# EAGLE schematic RedundantSensors (EAGLE 9.6.2)

## Sheet 1 of 2
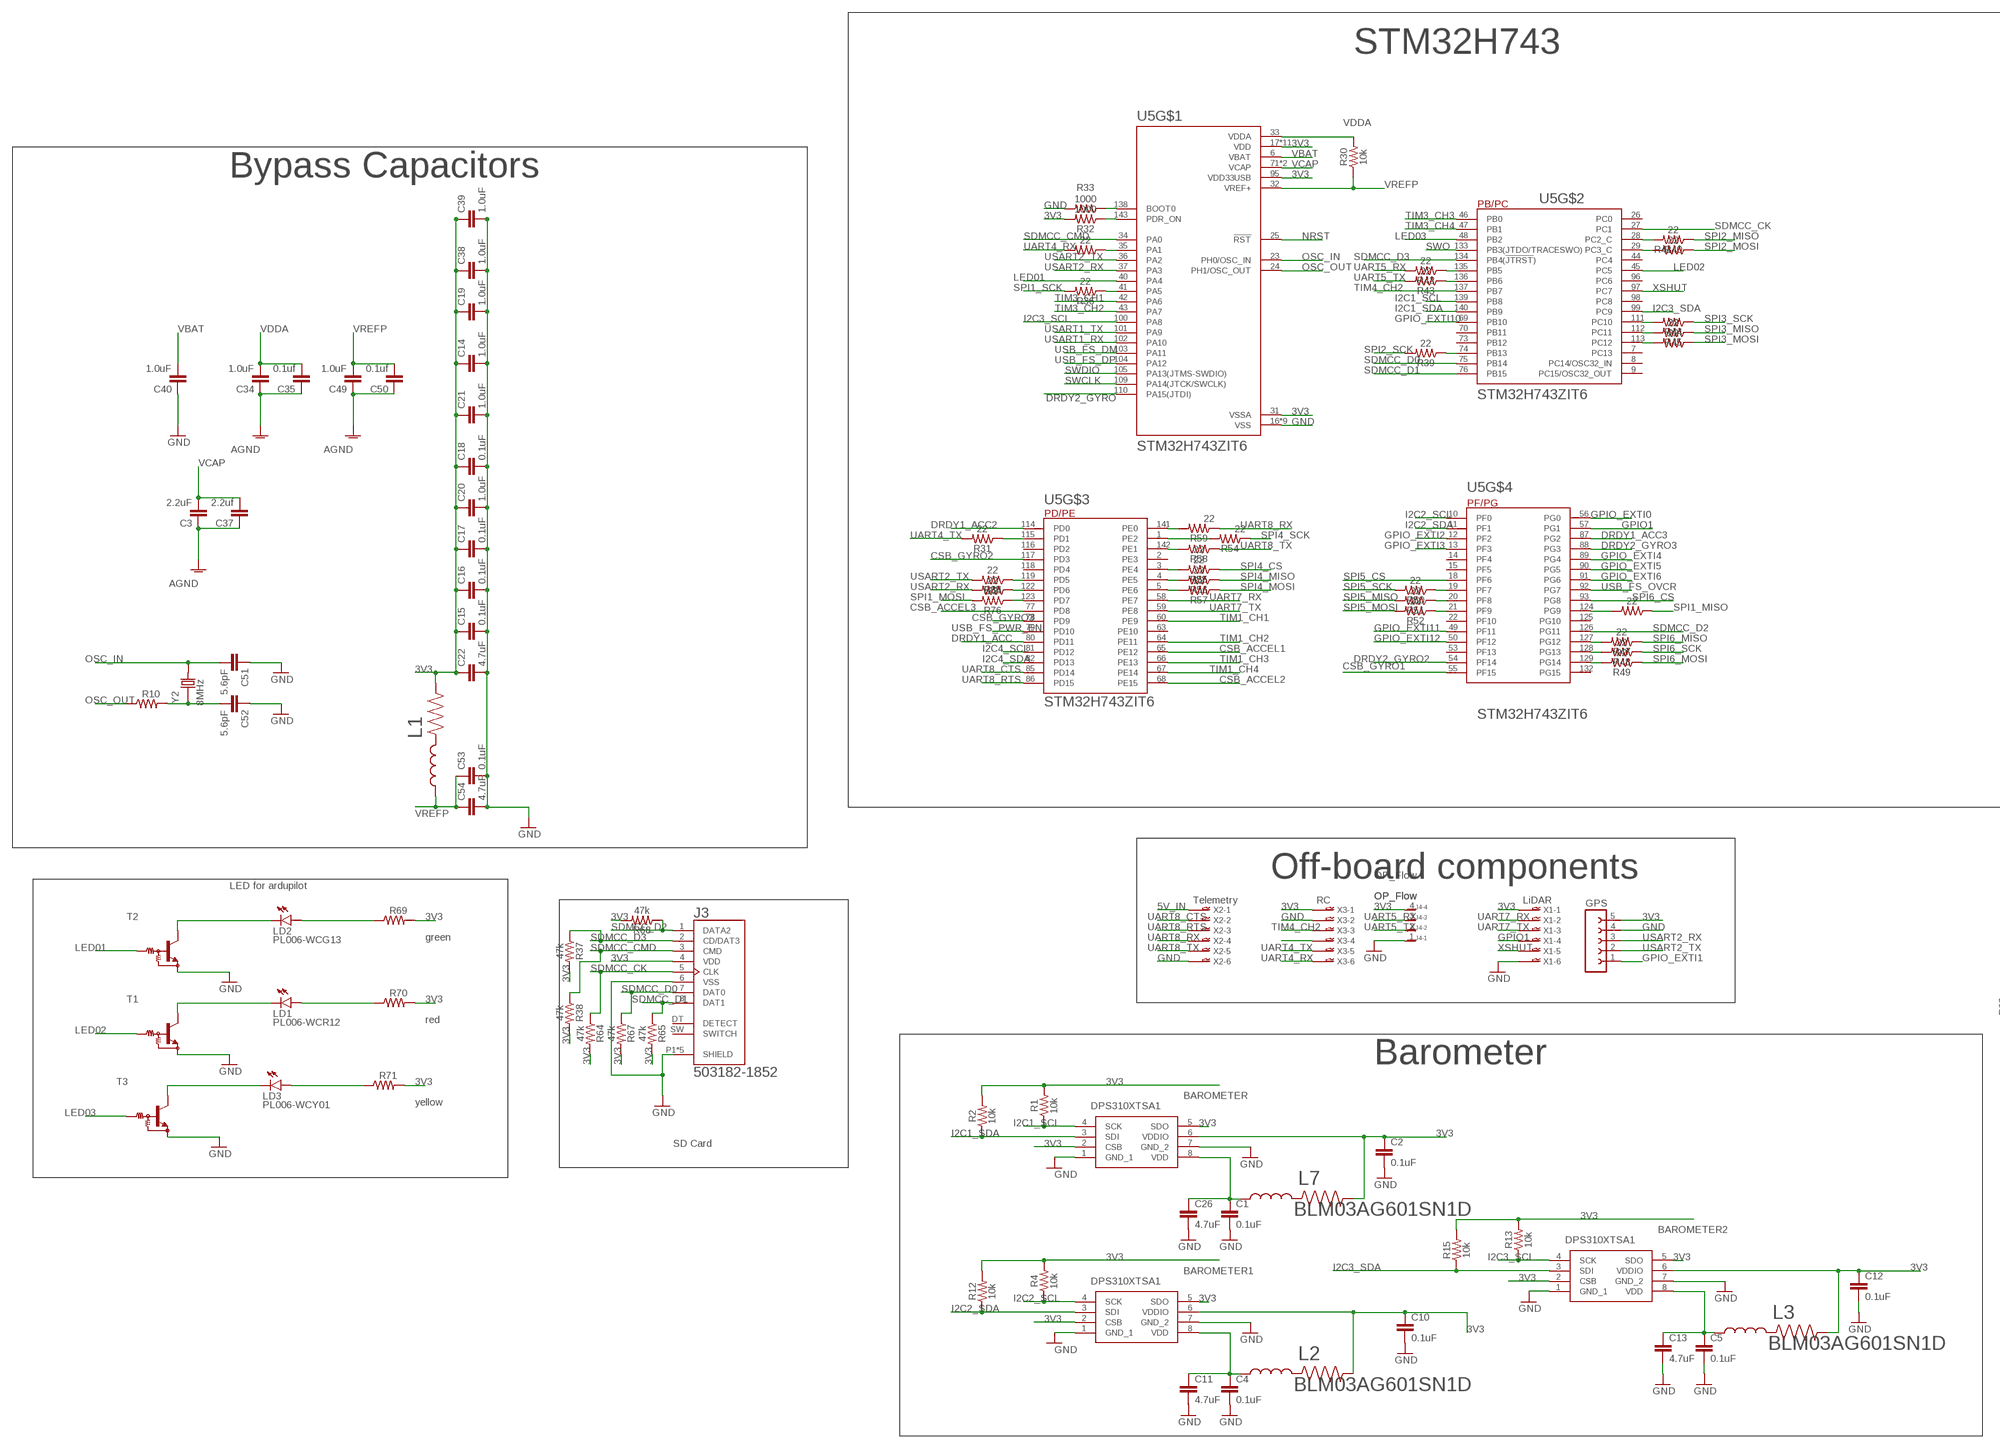
[diagram p0: schematic, sheet 1, part 1 of 2]
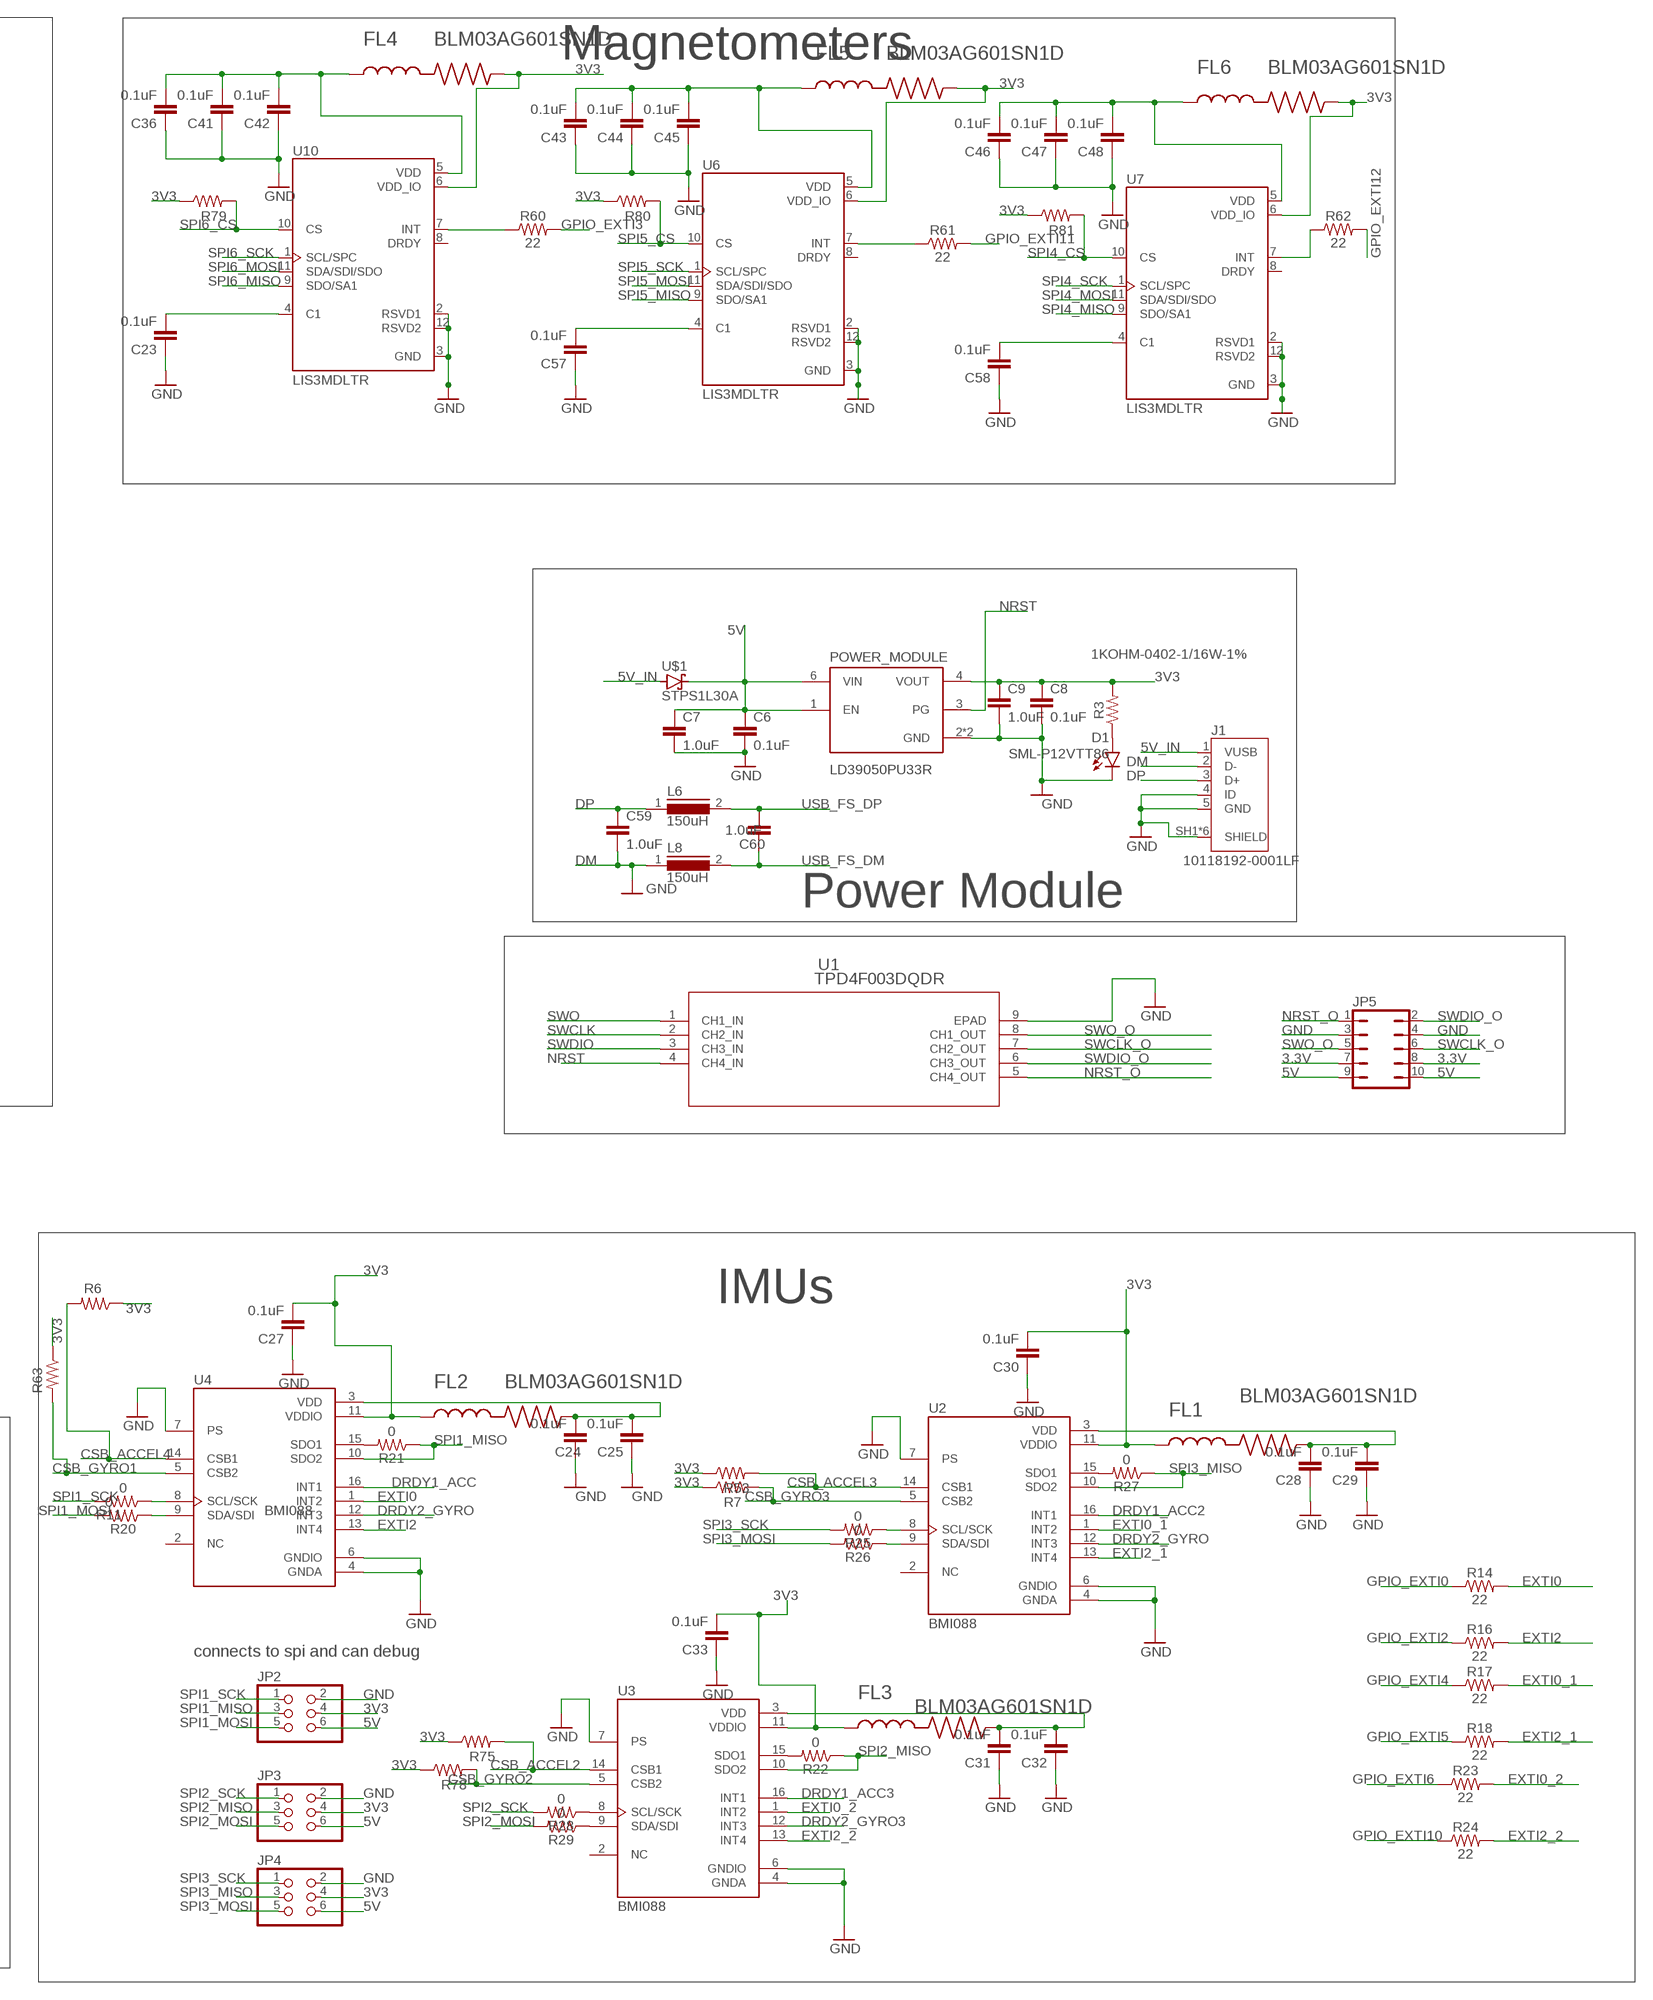
[diagram p1: schematic, sheet 1, part 2 of 2]

### Parts
BAROMETER  DPS310XTSA1  [DPS310XTSA1]
BAROMETER1  DPS310XTSA1  [DPS310XTSA1]
BAROMETER2  DPS310XTSA1  [DPS310XTSA1]
C1  0.1uF  0.1UF-0402-6.3V-10%-X7R  [0402]
C2  0.1uF  0.1UF-0402-6.3V-10%-X7R  [0402]
C3  2.2uF  1.0UF-0805-25V-10%  [0805]
C4  0.1uF  0.1UF-0402-6.3V-10%-X7R  [0402]
C5  0.1uF  0.1UF-0402-6.3V-10%-X7R  [0402]
C6  0.1uF  0.1UF-0402-6.3V-10%-X7R  [0402]
C7  1.0uF  1.0UF-0402-16V-10%  [0402]
C8  0.1uF  0.1UF-0402-6.3V-10%-X7R  [0402]
C9  1.0uF  1.0UF-0402-16V-10%  [0402]
C10  0.1uF  0.1UF-0402-6.3V-10%-X7R  [0402]
C11  4.7uF  4.7UF0603  [0603]
C12  0.1uF  0.1UF-0402-6.3V-10%-X7R  [0402]
C13  4.7uF  4.7UF0603  [0603]
C14  1.0uF  1.0UF-0805-25V-10%  [0805]
C15  0.1uF  0.1UF-0603-25V-5%  [0603]
C16  0.1uF  0.1UF-0603-25V-5%  [0603]
C17  0.1uF  0.1UF-0603-25V-5%  [0603]
C18  0.1uF  0.1UF-0603-25V-5%  [0603]
C19  1.0uF  1.0UF-0805-25V-10%  [0805]
C20  1.0uF  1.0UF-0805-25V-10%  [0805]
C21  1.0uF  1.0UF-0805-25V-10%  [0805]
C22  4.7uF  4.7UF0603  [0603]
C23  0.1uF  0.1UF-0603-25V-5%  [0603]
C24  0.1uF  0.1UF-0603-25V-5%  [0603]
C25  0.1uF  0.1UF-0603-25V-5%  [0603]
C26  4.7uF  4.7UF0603  [0603]
C27  0.1uF  0.1UF-0603-25V-5%  [0603]
C28  0.1uF  0.1UF-0603-25V-5%  [0603]
C29  0.1uF  0.1UF-0603-25V-5%  [0603]
C30  0.1uF  0.1UF-0603-25V-5%  [0603]
C31  0.1uF  0.1UF-0603-25V-5%  [0603]
C32  0.1uF  0.1UF-0603-25V-5%  [0603]
C33  0.1uF  0.1UF-0603-25V-5%  [0603]
C34  1.0uF  1.0UF-0805-25V-10%  [0805]
C35  0.1uf  1.0UF-0805-25V-10%  [0805]
C36  0.1uF  0.1UF-0603-25V-5%  [0603]
C37  2.2uf  1.0UF-0805-25V-10%  [0805]
C38  1.0uF  1.0UF-0805-25V-10%  [0805]
C39  1.0uF  1.0UF-0805-25V-10%  [0805]
C40  1.0uF  1.0UF-0805-25V-10%  [0805]
C41  0.1uF  0.1UF-0603-25V-5%  [0603]
C42  0.1uF  0.1UF-0603-25V-5%  [0603]
C43  0.1uF  0.1UF-0603-25V-5%  [0603]
C44  0.1uF  0.1UF-0603-25V-5%  [0603]
C45  0.1uF  0.1UF-0603-25V-5%  [0603]
C46  0.1uF  0.1UF-0603-25V-5%  [0603]
C47  0.1uF  0.1UF-0603-25V-5%  [0603]
C48  0.1uF  0.1UF-0603-25V-5%  [0603]
C49  1.0uF  1.0UF-0805-25V-10%  [0805]
C50  0.1uf  1.0UF-0805-25V-10%  [0805]
C51  5.6pF  1.0UF-0805-25V-10%  [0805]
C52  5.6pF  1.0UF-0805-25V-10%  [0805]
C53  0.1uF  0.1UF-0603-25V-5%  [0603]
C54  4.7uF  4.7UF0603  [0603]
C57  0.1uF  0.1UF-0603-25V-5%  [0603]
C58  0.1uF  0.1UF-0603-25V-5%  [0603]
C59  1.0uF  1.0UF-0402-16V-10%  [0402]
C60  1.0uF  1.0UF-0402-16V-10%  [0402]
D1  SML-P12VTT86  [LED_SML-P11UTT86R]
FL1  BLM03AG601SN1D  [BEADC0603X33N]
FL2  BLM03AG601SN1D  [BEADC0603X33N]
FL3  BLM03AG601SN1D  [BEADC0603X33N]
FL4  BLM03AG601SN1D  [BEADC0603X33N]
FL5  BLM03AG601SN1D  [BEADC0603X33N]
FL6  BLM03AG601SN1D  [BEADC0603X33N]
GPS  FE05-1  [FE05-1]
J1  10118192-0001LF  [AMPHENOL_10118192-0001LF]
J3  503182-1852  [MOLEX_503182-1852]
J4  JST-SH-4_SMT_V  [BM04B-SRSS-TB]
JP2  PINHD-2X3  [2X03]
JP3  PINHD-2X3  [2X03]
JP4  PINHD-2X3  [2X03]
JP5  JP5Q  [JP5Q]
L1  BLM03AG601SN1D  [BEADC0603X33N]
L2  BLM03AG601SN1D  [BEADC0603X33N]
L3  BLM03AG601SN1D  [BEADC0603X33N]
L6  150uH  MICC10  [MICC10]
L7  BLM03AG601SN1D  [BEADC0603X33N]
L8  150uH  MICC10  [MICC10]
LD1  PL006-WCR12  [SOT23]
LD2  PL006-WCG13  PL006-WCR12  [SOT23]
LD3  PL006-WCY01  PL006-WCR12  [SOT23]
POWER_MODULE  LD39050PU33R  [SON95P300X300X100-7N]
R1  10k  10KOHM-0402-1/16W-1%  [0402]
R2  10k  10KOHM-0402-1/16W-1%  [0402]
R3  1KOHM-0402-1/16W-1%  [0402]
R4  10k  10KOHM-0402-1/16W-1%  [0402]
R5  22  10KOHM-0402-1/16W-1%  [0402]
R6  10K  RT0402FRE07220RL  [RESC1005X35N]
R7  10K  RT0402FRE07220RL  [RESC1005X35N]
R10  220  RT0402FRE07220RL  [RESC1005X35N]
R11  0  10KOHM-0402-1/16W-1%  [0402]
R12  10k  10KOHM-0402-1/16W-1%  [0402]
R13  10k  10KOHM-0402-1/16W-1%  [0402]
R14  22  22OHM-0402-1/10W-1%  [0402]
R15  10k  10KOHM-0402-1/16W-1%  [0402]
R16  22  22OHM-0402-1/10W-1%  [0402]
R17  22  22OHM-0402-1/10W-1%  [0402]
R18  22  22OHM-0402-1/10W-1%  [0402]
R20  0  10KOHM-0402-1/16W-1%  [0402]
R21  0  10KOHM-0402-1/16W-1%  [0402]
R22  0  10KOHM-0402-1/16W-1%  [0402]
R23  22  22OHM-0402-1/10W-1%  [0402]
R24  22  22OHM-0402-1/10W-1%  [0402]
R25  0  10KOHM-0402-1/16W-1%  [0402]
R26  0  10KOHM-0402-1/16W-1%  [0402]
R27  0  10KOHM-0402-1/16W-1%  [0402]
R28  0  10KOHM-0402-1/16W-1%  [0402]
R29  0  10KOHM-0402-1/16W-1%  [0402]
R30  10k  10KOHM-0402-1/16W-1%  [0402]
R31  22  10KOHM-0402-1/16W-1%  [0402]
R32  1000  10KOHM-0402-1/16W-1%  [0402]
R33  1000  10KOHM-0402-1/16W-1%  [0402]
R34  22  10KOHM-0402-1/16W-1%  [0402]
R35  22  10KOHM-0402-1/16W-1%  [0402]
R36  22  10KOHM-0402-1/16W-1%  [0402]
R37  47k  10KOHM-0402-1/16W-1%  [0402]
R38  47k  10KOHM-0402-1/16W-1%  [0402]
R39  22  10KOHM-0402-1/16W-1%  [0402]
R40  22  10KOHM-0402-1/16W-1%  [0402]
R41  22  10KOHM-0402-1/16W-1%  [0402]
R42  22  10KOHM-0402-1/16W-1%  [0402]
R43  22  10KOHM-0402-1/16W-1%  [0402]
R44  22  10KOHM-0402-1/16W-1%  [0402]
R45  22  10KOHM-0402-1/16W-1%  [0402]
R46  22  10KOHM-0402-1/16W-1%  [0402]
R47  22  10KOHM-0402-1/16W-1%  [0402]
R48  22  10KOHM-0402-1/16W-1%  [0402]
R49  22  10KOHM-0402-1/16W-1%  [0402]
R50  22  10KOHM-0402-1/16W-1%  [0402]
R51  22  10KOHM-0402-1/16W-1%  [0402]
R52  22  10KOHM-0402-1/16W-1%  [0402]
R53  10K  RT0402FRE07220RL  [RESC1005X35N]
R54  22  10KOHM-0402-1/16W-1%  [0402]
R55  22  10KOHM-0402-1/16W-1%  [0402]
R56  22  10KOHM-0402-1/16W-1%  [0402]
R57  22  10KOHM-0402-1/16W-1%  [0402]
R58  22  10KOHM-0402-1/16W-1%  [0402]
R59  22  10KOHM-0402-1/16W-1%  [0402]
R60  22  22OHM-0402-1/10W-1%  [0402]
R61  22  22OHM-0402-1/10W-1%  [0402]
R62  22  22OHM-0402-1/10W-1%  [0402]
R63  10K  RT0402FRE07220RL  [RESC1005X35N]
R64  47k  10KOHM-0402-1/16W-1%  [0402]
R65  47k  10KOHM-0402-1/16W-1%  [0402]
R67  47k  10KOHM-0402-1/16W-1%  [0402]
R68  47k  10KOHM-0402-1/16W-1%  [0402]
R69  270  RT0402FRE07220RL  [RESC1005X35N]
R70  270  RT0402FRE07220RL  [RESC1005X35N]
R71  270  RT0402FRE07220RL  [RESC1005X35N]
R75  10K  RT0402FRE07220RL  [RESC1005X35N]
R76  22  10KOHM-0402-1/16W-1%  [0402]
R77  22  10KOHM-0402-1/16W-1%  [0402]
R78  10K  RT0402FRE07220RL  [RESC1005X35N]
R79  10K  RT0402FRE07220RL  [RESC1005X35N]
R80  10K  RT0402FRE07220RL  [RESC1005X35N]
R81  10K  RT0402FRE07220RL  [RESC1005X35N]
T1  MUN2213T1-NPN_DRIVER-SC59-BEC  [SC59-BEC]
T2  MUN2213T1-NPN_DRIVER-SC59-BEC  [SC59-BEC]
T3  MUN2213T1-NPN_DRIVER-SC59-BEC  [SC59-BEC]
U1  TPD4F003DQDR  [DQD8_1P2X0P4]
U2  BMI088  [PQFN50P450X300X100-16N]
U3  BMI088  [PQFN50P450X300X100-16N]
U4  BMI088  [PQFN50P450X300X100-16N]
U5  STM32H743ZIT6  [QFP50P2200X2200X160-144N]
U6  LIS3MDLTR  [XDCR_LIS3MDLTR]
U7  LIS3MDLTR  [XDCR_LIS3MDLTR]
U10  LIS3MDLTR  [XDCR_LIS3MDLTR]
U$1  STPS1L30A  [DIOM5226X223N]
X1  LiDAR  06FLZ-SM1  [6FLZ-SM]
X2  Telemetry  06FLZ-SM1  [6FLZ-SM]
X3  RC  06FLZ-SM1  [6FLZ-SM]
Y2  8MHz  ABLS-8.000MHZ-B2-T  [XTAL_ABLS-8.000MHZ-B2-T]

### Nets
3.3V: JP5.7 JP5.8
3V2: C28.2 C29.2 FL1.2 U2.3(VDD)
3V3: BAROMETER1.2(CSB) BAROMETER1.5(SDO) BAROMETER1.6(VDDIO) BAROMETER2.2(CSB) BAROMETER2.5(SDO) BAROMETER2.6(VDDIO) BAROMETER.2(CSB) BAROMETER.5(SDO) BAROMETER.6(VDDIO) C2.1 C8.1 C9.1 C10.1 C12.1 C14.1 C15.1 C16.1 C17.1 C18.1 C19.1 C20.1 C21.1 C22.1 C27.2 C30.2 C33.2 C38.1 C39.1 FL1.1 FL2.1 FL3.1 FL4.2 FL5.2 FL6.2 GPS.5 J3.4(VDD) J4.4 JP2.4 JP3.4 JP4.4 L1.2 L2.2 L3.2 L7.2 POWER_MODULE.4(VOUT) R1.2 R2.2 R3.2 R4.2 R6.1 R7.1 R12.2 R13.2 R15.2 R32.2 R37.2 R38.2 R53.1 R63.1 R64.2 R65.2 R67.2 R68.2 R69.2 R70.2 R71.2 R75.1 R78.1 R79.1 R80.1 R81.1 U2.11(VDDIO) U3.11(VDDIO) U4.11(VDDIO) U5.17(VDD) U5.30(VDD) U5.31(VSSA) U5.39(VDD) U5.52(VDD) U5.62(VDD) U5.72(VDD) U5.84(VDD) U5.95(VDD33USB) U5.108(VDD) U5.121(VDD) U5.131(VDD) U5.144(VDD) U6.6(VDD_IO) U7.6(VDD_IO) U10.6(VDD_IO) X1.1 X3.1
3V4: C24.2 C25.2 FL2.2 U4.3(VDD)
3V5: C31.2 C32.2 FL3.2 U3.3(VDD)
5V: C6.1 C7.1 JP2.6 JP3.6 JP4.6 JP5.9 JP5.10 POWER_MODULE.1(EN) POWER_MODULE.6(VIN) U$1.1(C)
5V_IN: J1.1(VUSB) U$1.2(A) X2.1
AGND: C3.1 C34.1 C35.1 C37.1 C49.1 C50.1
CSB_ACCEL1: U5.65(PE12)
CSB_ACCEL2: R75.2 U3.14(CSB1) U5.68(PE15)
CSB_ACCEL3: R53.2 U2.14(CSB1) U5.77(PD8)
CSB_ACCEL4: R6.2 U4.14(CSB1)
CSB_GYRO1: R63.2 U4.5(CSB2) U5.55(PF15)
CSB_GYRO2: R78.2 U3.5(CSB2) U5.117(PD3)
CSB_GYRO3: R7.2 U2.5(CSB2) U5.78(PD9)
DM: C59.2 J1.2(D-) L8.1 ; supply symbol labelled GND
DP: C59.1 J1.3(D+) L6.1
DRDY1_ACC: U4.16(INT1) U5.80(PD11)
DRDY1_ACC2: U2.16(INT1) U5.114(PD0)
DRDY1_ACC3: U3.16(INT1) U5.87(PG2)
DRDY2_GYRO: U2.12(INT3) U4.12(INT3) U5.110(PA15(JTDI))
DRDY2_GYRO2: U5.54(PF14)
DRDY2_GYRO3: U3.12(INT3) U5.88(PG3)
EXTI0: R14.2 U4.1(INT2)
EXTI0_1: R17.2 U2.1(INT2)
EXTI0_2: R23.2 U3.1(INT2)
EXTI2: R16.2 U4.13(INT4)
EXTI2_1: R18.2 U2.13(INT4)
EXTI2_2: R24.2 U3.13(INT4)
GND: BAROMETER1.1(GND_1) BAROMETER1.7(GND_2) BAROMETER2.1(GND_1) BAROMETER2.7(GND_2) BAROMETER.1(GND_1) BAROMETER.7(GND_2) C1.2 C2.2 C4.2 C5.2 C6.2 C7.2 C8.2 C9.2 C10.2 C11.2 C12.2 C13.2 C14.2 C15.2 C16.2 C17.2 C18.2 C19.2 C20.2 C21.2 C22.2 C23.1 C24.1 C25.1 C26.2 C27.1 C28.1 C29.1 C30.1 C31.1 C32.1 C33.1 C36.1 C38.2 C39.2 C40.1 C41.1 C42.1 C43.1 C44.1 C45.1 C46.1 C47.1 C48.1 C51.1 C52.1 C53.2 C54.2 C57.1 C58.1 D1.C GPS.4 J1.4(ID) J1.5(GND) J1.SH1(SHIELD) J1.SH2(SHIELD) J1.SH3(SHIELD) J1.SH4(SHIELD) J1.SH5(SHIELD) J1.SH6(SHIELD) J3.6(VSS) J3.P1(SHIELD) J3.P2(SHIELD) J3.P3(SHIELD) J3.P4(SHIELD) J3.P5(SHIELD) J4.1 JP2.2 JP3.2 JP4.2 JP5.3 JP5.4 POWER_MODULE.2(GND) POWER_MODULE.7(GND) R33.2 T1.E T2.E T3.E U1.9(EPAD) U2.4(GNDA) U2.6(GNDIO) U2.7(PS) U3.4(GNDA) U3.6(GNDIO) U3.7(PS) U4.4(GNDA) U4.6(GNDIO) U4.7(PS) U5.16(VSS) U5.38(VSS) U5.51(VSS) U5.61(VSS) U5.83(VSS) U5.94(VSS) U5.107(VSS) U5.120(VSS) U5.130(VSS) U6.2(RSVD1) U6.3(GND) U6.12(RSVD2) U7.2(RSVD1) U7.3(GND) U7.12(RSVD2) U10.2(RSVD1) U10.3(GND) U10.12(RSVD2) X1.6 X2.6 X3.2
GPIO1: U5.57(PG1) X1.4
GPIO_EXTI0: R14.1 U5.56(PG0)
GPIO_EXTI1: GPS.1
GPIO_EXTI2: R16.1 U5.12(PF2)
GPIO_EXTI3: R60.2 U5.13(PF3)
GPIO_EXTI4: R17.1 U5.89(PG4)
GPIO_EXTI5: R18.1 U5.90(PG5)
GPIO_EXTI6: R23.1 U5.91(PG6)
GPIO_EXTI10: R24.1 U5.69(PB10)
GPIO_EXTI11: R61.2 U5.49(PF11)
GPIO_EXTI12: R62.2 U5.50(PF12)
I2C1_SCL: BAROMETER.4(SCK) R1.1 U5.139(PB8)
I2C1_SDA: BAROMETER.3(SDI) R2.1 U5.140(PB9)
I2C2_SCL: BAROMETER1.4(SCK) R4.1 U5.10(PF0)
I2C2_SDA: BAROMETER1.3(SDI) R12.1 U5.11(PF1)
I2C3_SCL: BAROMETER2.4(SCK) R13.1 U5.100(PA8)
I2C3_SDA: BAROMETER2.3(SDI) R15.1 U5.99(PC9)
I2C4_SCL: U5.81(PD12)
I2C4_SDA: U5.82(PD13)
LED01: T2.B U5.40(PA4)
LED02: T1.B U5.45(PC5)
LED03: T3.B U5.48(PB2)
N$2: BAROMETER2.8(VDD) C5.1 C13.1 L3.1
N$3: BAROMETER1.8(VDD) C4.1 C11.1 L2.1
N$5: D1.A R3.1
N$6: BAROMETER.8(VDD) C1.1 C26.1 L7.1
N$7: C52.2 R10.2 Y2.1
N$11: C23.2 U10.4(C1)
N$12: R32.1 U5.143(PDR_ON)
N$13: R55.2 U5.3(PE4)
N$14: R56.2 U5.4(PE5)
N$15: X3.4
N$16: C36.2 C41.2 C42.2 FL4.1 U10.5(VDD)
N$17: C57.2 U6.4(C1)
N$18: R33.1 U5.138(BOOT0)
N$20: R5.1 U5.35(PA1)
N$21: R11.1 U4.8(SCL/SCK)
N$22: R20.1 U4.9(SDA/SDI)
N$23: R40.2 U5.28(PC2_C)
N$24: R21.2 U4.15(SDO1)
N$25: R22.2 U3.15(SDO1)
N$26: R25.1 U2.8(SCL/SCK)
N$27: R26.1 U2.9(SDA/SDI)
N$28: R27.2 U2.15(SDO1)
N$29: R28.1 U3.8(SCL/SCK)
N$30: R29.1 U3.9(SDA/SDI)
N$31: R34.1 U5.122(PD6)
N$32: R35.1 U5.119(PD5)
N$33: R36.1 U5.41(PA5)
N$36: R39.1 U5.74(PB13)
N$37: R41.2 U5.29(PC3_C)
N$38: R31.1 U5.115(PD1)
N$39: R42.1 U5.135(PB5)
N$40: R43.1 U5.136(PB6)
N$41: R44.2 U5.111(PC10)
N$42: R45.2 U5.112(PC11)
N$43: R46.2 U5.113(PC12)
N$44: R47.2 U5.127(PG12)
N$45: R48.2 U5.128(PG13)
N$46: R49.2 U5.129(PG14)
N$47: R50.1 U5.19(PF7)
N$48: R51.1 U5.20(PF8)
N$49: R52.1 U5.21(PF9)
N$50: R57.2 U5.5(PE6)
N$51: R58.2 U5.142(PE1)
N$52: R59.2 U5.141(PE0)
N$53: C43.2 C44.2 C45.2 FL5.1 U6.5(VDD)
N$54: C58.2 U7.4(C1)
N$55: C46.2 C47.2 C48.2 FL6.1 U7.5(VDD)
N$56: R60.1 U10.7(INT)
N$57: R61.1 U6.7(INT)
N$58: R62.1 U7.7(INT)
N$59: LD2.3(C) T2.C
N$60: LD2.1(A) R69.1
N$61: LD1.3(C) T1.C
N$62: LD1.1(A) R70.1
N$63: LD3.3(C) T3.C
N$64: LD3.1(A) R71.1
N$67: R54.2 U5.1(PE2)
N$68: R76.1 U5.123(PD7)
N$69: R77.2 U5.124(PG9)
NRST: POWER_MODULE.3(PG) U1.4(CH4_IN) U5.25(!RST)
NRST_O: JP5.1 U1.5(CH4_OUT)
OSC_IN: C51.2 U5.23(PH0/OSC_IN) Y2.2
OSC_OUT: R10.1 U5.24(PH1/OSC_OUT)
SDMCC_CK: J3.5(CLK) R64.1 U5.27(PC1)
SDMCC_CMD: J3.3(CMD) R38.1 U5.34(PA0)
SDMCC_D0: J3.7(DAT0) R67.1 U5.75(PB14)
SDMCC_D1: J3.8(DAT1) R65.1 U5.76(PB15)
SDMCC_D2: J3.1(DATA2) R68.1 U5.126(PG11)
SDMCC_D3: J3.2(CD/DAT3) R37.1 U5.134(PB4(!JTRST!))
SPI1_MISO: JP2.3 R21.1 R77.1 U4.10(SDO2)
SPI1_MOSI: JP2.5 R20.2 R76.2
SPI1_SCK: JP2.1 R11.2 R36.2
SPI2_MISO: JP3.3 R22.1 R40.1 U3.10(SDO2)
SPI2_MOSI: JP3.5 R29.2 R41.1
SPI2_SCK: JP3.1 R28.2 R39.2
SPI3_MISO: JP4.3 R27.1 R45.1 U2.10(SDO2)
SPI3_MOSI: JP4.5 R26.2 R46.1
SPI3_SCK: JP4.1 R25.2 R44.1
SPI4_CS: R55.1 R81.2 U7.10(CS)
SPI4_MISO: R56.1 U7.9(SDO/SA1)
SPI4_MOSI: R57.1 U7.11(SDA/SDI/SDO)
SPI4_SCK: R54.1 U7.1(SCL/SPC)
SPI5_CS: R80.2 U5.18(PF6) U6.10(CS)
SPI5_MISO: R51.2 U6.9(SDO/SA1)
SPI5_MOSI: R52.2 U6.11(SDA/SDI/SDO)
SPI5_SCK: R50.2 U6.1(SCL/SPC)
SPI6_CS: R79.2 U5.93(PG8) U10.10(CS)
SPI6_MISO: R47.1 U10.9(SDO/SA1)
SPI6_MOSI: R49.1 U10.11(SDA/SDI/SDO)
SPI6_SCK: R48.1 U10.1(SCL/SPC)
SWCLK: U1.2(CH2_IN) U5.109(PA14(JTCK/SWCLK))
SWCLK_O: JP5.6 U1.7(CH2_OUT)
SWDIO: U1.3(CH3_IN) U5.105(PA13(JTMS-SWDIO))
SWDIO_O: JP5.2 U1.6(CH3_OUT)
SWO: U1.1(CH1_IN) U5.133(PB3(JTDO/TRACESWO))
SWO_O: JP5.5 U1.8(CH1_OUT)
TIM1_CH1: U5.60(PE9)
TIM1_CH2: U5.64(PE11)
TIM1_CH3: U5.66(PE13)
TIM1_CH4: U5.67(PE14)
TIM3_CH1: U5.42(PA6)
TIM3_CH2: U5.43(PA7)
TIM3_CH3: U5.46(PB0)
TIM3_CH4: U5.47(PB1)
TIM4_CH2: U5.137(PB7) X3.3
UART4_RX: R5.2 X3.6
UART4_TX: R31.2 X3.5
UART5_RX: J4.3 R42.2
UART5_TX: J4.2 R43.2
UART7_RX: U5.58(PE7) X1.2
UART7_TX: U5.59(PE8) X1.3
UART8_CTS: U5.85(PD14) X2.2
UART8_RTS: U5.86(PD15) X2.3
UART8_RX: R59.1 X2.4
UART8_TX: R58.1 X2.5
USART1_RX: U5.102(PA10)
USART1_TX: U5.101(PA9)
USART2_RX: GPS.3 R34.2 U5.37(PA3)
USART2_TX: GPS.2 R35.2 U5.36(PA2)
USB_FS_DM: C60.2 L8.2 U5.103(PA11)
USB_FS_DP: C60.1 L6.2 U5.104(PA12)
USB_FS_OVCR: U5.92(PG7)
USB_FS_PWR_EN: U5.79(PD10)
VBAT: C40.2 U5.6(VBAT)
VCAP: C3.2 C37.2 U5.71(VCAP) U5.106(VCAP)
VDDA: C34.2 C35.2 R30.2 U5.33(VDDA)
VREFP: C49.2 C50.2 C53.1 C54.1 L1.1 R30.1 U5.32(VREF+)
XSHUT: U5.97(PC7) X1.5
Unconnected: J3.DT(DETECT) J3.SW(SWITCH) J4.M1 J4.M2 U2.2(NC) U3.2(NC) U4.2(NC) U5.2(PE3) U5.7(PC13) U5.8(PC14/OSC32_IN) U5.9(PC15/OSC32_OUT) U5.14(PF4) U5.15(PF5) U5.22(PF10) U5.26(PC0) U5.44(PC4) U5.53(PF13) U5.63(PE10) U5.70(PB11) U5.73(PB12) U5.96(PC6) U5.98(PC8) U5.116(PD2) U5.118(PD4) U5.125(PG10) U5.132(PG15) U6.8(DRDY) U7.8(DRDY) U10.8(DRDY)

### Notes on the sheet
- STM32H743 | Magnetometers
- Bypass Capacitors
- Power Module
- Off-board components | OP_Flow
- LED for ardupilot
- OP_Flow | OP_Flow
- green
- IMUs
- red
- Barometer
- yellow
- SD Card
- connects to spi and can debug

## Sheet 2 of 2

## Library data of the parts
BAROMETER BAROMETER1 BAROMETER2 = DPS310XTSA1:DPS310XTSA1: INFINEON - DPS310XTSA1 - DIGITAL PRESSURE SENSOR, 1200HPA, VLGA-8 Source: Datasheet <https://www.infineon.com/dgdl/Infineon-DPS310-DS-v01_00-EN.pdf?fileId=5546d462576f34750157750826c42242>; ARROW_PART_NUMBER: DPS310XTSA1; ARROW_PRICE-STOCK: https://www.arrow.com/en/products/dps310xtsa1/infineon-technologies-ag?region=nac; DESCRIPTION: INFINEON - DPS310XTSA1 - DIGITAL PRESSURE SENSOR, 1200HPA, VLGA-8; HEIGHT: 1.01mm; MANUFACTURER_NAME: Infineon; MANUFACTURER_PART_NUMBER: DPS310XTSA1; MOUSER_PART_NUMBER: 726-DPS310XTSA1; MOUSER_PRICE-STOCK: https://www.mouser.co.uk/ProductDetail/Infineon-Technologies/DPS310XTSA1?qs=uuTTuBTXn66Ynca8WHwycg%3D%3D
C1 C2 C4-C6 C8 C10 C12 = SparkFun-Capacitors:0.1UF: 0.1µF ceramic capacitors A capacitor is a passive two-terminal electrical component used to store electrical energy temporarily in an electric field.; PROD_ID: CAP-14993
C3 C35 C37 C50-C52 = SparkFun-Capacitors:1.0UF: 1µF ceramic capacitors A capacitor is a passive two-terminal electrical component used to store electrical energy temporarily in an electric field.; PROD_ID: CAP-08064; VALUE: 1.0uF
C7 C9 C59 C60 = SparkFun-Capacitors:1.0UF: 1µF ceramic capacitors A capacitor is a passive two-terminal electrical component used to store electrical energy temporarily in an electric field.; PROD_ID: CAP-12417
C11 C13 C22 C26 C54 = SparkFun-Capacitors:4.7UF: 4.7µF ceramic capacitors A capacitor is a passive two-terminal electrical component used to store electrical energy temporarily in an electric field.; PROD_ID: CAP-08280
C14 C19-C21 C34 C38-C40 C49 = SparkFun-Capacitors:1.0UF: 1µF ceramic capacitors A capacitor is a passive two-terminal electrical component used to store electrical energy temporarily in an electric field.; PROD_ID: CAP-08064
C15-C18 C23-C25 C27-C33 C36 C41-C48 C53 C57 C58 = SparkFun-Capacitors:0.1UF: 0.1µF ceramic capacitors A capacitor is a passive two-terminal electrical component used to store electrical energy temporarily in an electric field.; PROD_ID: CAP-08604
D1 = ce-capstone:SML-P12VTT86: SML-P1 Series Red 0402 Clear 60 mcd 2 V Surface Mount PICOLED LED; AVAILABILITY: Unavailable; DESCRIPTION: Red 630nm LED Indication - Discrete 2V 0402 _1006 Metric_; MF: Rohm; MP: SML-P12VTT86; PACKAGE: 0402 Rohm; PRICE: None
FL1-FL6 L1-L3 L7 = BLM03AG601SN1D:BLM03AG601SN1D: Ferrite Bead 600R 100mA SMD 0201 Check availability <https://pricing.snapeda.com/parts/BLM03AG601SN1D/Murata%20Electronics/view-part?ref=eda>; AVAILABILITY: In Stock; CHECK_PRICES: https://www.snapeda.com/parts/BLM03AG601SN1D/Murata/view-part/?ref=eda; DESCRIPTION: 600 Ohms @ 100 MHz 1 - Ferrite Bead 0201 (0603 Metric) 100mA 1.5Ohm; MF: Murata Electronics; MP: BLM03AG601SN1D; PACKAGE: 0603 Murata; PRICE: None; PURCHASE-URL: https://www.snapeda.com/api/url_track_click_mouser/?unipart_id=283112&manufacturer=Murata Electronics&part_name=BLM03AG601SN1D&search_term=None; SNAPEDA_LINK: https://www.snapeda.com/parts/BLM03AG601SN1D/Murata/view-part/?ref=snap
GPS = con-lsta:FE05-1: FEMALE HEADER; OC_FARNELL: unknown; OC_NEWARK: unknown
J1 = ce-capstone:10118192-0001LF: Single Port 5 Contact Horizontal Right Angle Shielded Micro B USB 2.0 Connector; AVAILABILITY: Unavailable; DESCRIPTION: USB - micro B USB 2.0 Receptacle Connector 5 Position Surface Mount, Right Angle; MF: Amphenol ICC; MP: 10118192-0001LF; PACKAGE: None; PRICE: None
J3 = 503182-1852:503182-1852: Conn Micro SD Card M 8 POS 1.09mm Solder RA SMD Embossed T/R 0.5A/Contact Check availability <https://pricing.snapeda.com/parts/5031821852/Molex/view-part?ref=eda>; AVAILABILITY: In Stock; CHECK_PRICES: https://www.snapeda.com/parts/5031821852/Molex/view-part/?ref=eda; DESCRIPTION: 10 (8 + 2) Position Card Connector Secure Digital - microSD™ Surface Mount, Right Angle Gold; MF: Molex; MP: 5031821852; PACKAGE: None; PRICE: None; PURCHASE-URL: https://www.snapeda.com/api/url_track_click_mouser/?unipart_id=46835&manufacturer=Molex&part_name=5031821852&search_term=None; SNAPEDA_LINK: https://www.snapeda.com/parts/5031821852/Molex/view-part/?ref=snap
J4 = con-JST-SH:JST-SH-4; MF: JST; MPN: BM04B-SRSS-TB
JP2-JP4 = pinhead:PINHD-2X3: PIN HEADER
JP5 = jumper:JP5Q: JUMPER
L6 L8 = inductors:MICC10: INDUCTOR; SPICEPREFIX: L
LD1-LD3 = led:PL006*: PLH006 Series SMD LED SOT23 PLH006-WCR21 Super Red PLH006-WCR12 High Eff Red PLH006-WCG13 Green PLH006-WCY01 Yellow www.p-tec.net Source: http://www.wittig-electronic.de/PTEC/PL006Series.pdf
POWER_MODULE = ce-capstone:LD39050PU33R: LD39050 Series 500 mA 3.3 V Fixed Low Noise LDO Voltage Regulator - DFN-6; AVAILABILITY: Unavailable; DESCRIPTION: Linear Voltage Regulator IC 1 Output 500mA 6-DFN _3x3_; MF: STMicroelectronics; MP: LD39050PU33R; PACKAGE: DFN-6 STMicroelectronics; PRICE: None
R1 R2 R4 R12 R13 R15 R30 = SparkFun-Resistors:10KOHM: 10kΩ resistor A resistor is a passive two-terminal electrical component that implements electrical resistance as a circuit element. Resistors act to reduce current flow, and, at the same time, act to lower voltage levels within circuits. - Wikipedia; PROD_ID: RES-14241
R3 = SparkFun-Resistors:1KOHM: 1kΩ resistor A resistor is a passive two-terminal electrical component that implements electrical resistance as a circuit element. Resistors act to reduce current flow, and, at the same time, act to lower voltage levels within circuits. - Wikipedia; PROD_ID: RES-14342
R5 R11 R20-R22 R25-R29 R31-R52 R54-R59 R64 R65 R67 R68 R76 R77 = SparkFun-Resistors:10KOHM: 10kΩ resistor A resistor is a passive two-terminal electrical component that implements electrical resistance as a circuit element. Resistors act to reduce current flow, and, at the same time, act to lower voltage levels within circuits. - Wikipedia; PROD_ID: RES-14241; VALUE: 10k
R6 R7 R10 R53 R63 R69-R71 R75 R78-R81 = ce-capstone:RT0402FRE07220RL: RES SMD 4.7K OHM 1% 1/16W 0402; DESCRIPTION: 4.7 kOhms ±1% 0.063W, 1/16W Chip Resistor 0402 _1005 Metric_ Thin Film; DIGI-KEY_PART_NUMBER: YAG3347CT-ND; DIGI-KEY_PURCHASE_URL: https://www.digikey.com/product-detail/en/yageo/RT0402FRE074K7L/YAG3347CT-ND/5418052?utm_source=snapeda&utm_medium=aggregator&utm_campaign=symbol; MF: Yageo; MP: RT0402FRE074K7L; PACKAGE: 1005 Yageo
R14 R16-R18 R23 R24 R60-R62 = SparkFun-Resistors:22OHM: 22Ω resistor A resistor is a passive two-terminal electrical component that implements electrical resistance as a circuit element. Resistors act to reduce current flow, and, at the same time, act to lower voltage levels within circuits. - Wikipedia; PROD_ID: RES-12427
T1-T3 = transistor:*-NPN_DRIVER-: NPN Bias Resistor Transistor
U1 = TPD4F003DQDR:TPD4F003DQDR; COPYRIGHT: Copyright (C) 2023 Ultra Librarian. All rights reserved.; DIGI-KEY_PART_NUMBER_1: 296-25817-1-ND; DIGI-KEY_PART_NUMBER_2: 296-25817-2-ND; DIGI-KEY_PART_NUMBER_3: 296-25817-6-ND; DIGI-KEY_PART_NUMBER_4: 2156-TPD4F003DQDR-ND; MANUFACTURER_PART_NUMBER: TPD4F003DQDR; MFR_NAME: Texas Instruments
U2-U4 = BMI088:BMI088: High-performance 6-axis inertial sensor (accelerometer + gyroscope) Check prices <https://pricing.snapeda.com/parts/BMI088/Bosch%20Sensortec/view-part?ref=eda> Check availability <https://pricing.snapeda.com/parts/BMI088/Bosch%20Sensortec/view-part?ref=eda>; AVAILABILITY: In Stock; CHECK_PRICES: https://www.snapeda.com/parts/BMI088/Bosch+Sensortec/view-part/?ref=eda; DESCRIPTION: Accelerometer, Gyroscope, 6 Axis Sensor I2C, SPI Output; MF: Bosch Sensortec; MP: BMI088; PACKAGE: VFLGA-16 Bosch Sensortec; PRICE: None; PURCHASE-URL: https://www.snapeda.com/api/url_track_click_mouser/?unipart_id=2774026&manufacturer=Bosch Sensortec&part_name=BMI088&search_term=None; SNAPEDA_LINK: https://www.snapeda.com/parts/BMI088/Bosch+Sensortec/view-part/?ref=snap
U5 = STM32H743ZIT6:STM32H743ZIT6: High-performance and DSP with DP-FPU, ARM Cortex-M7 MCU with 2MBytes Flash, 1MB RAM, 400 MHz CPU, Art Accelerator, L1... Check availability <https://pricing.snapeda.com/parts/STM32H743ZIT6/STMicroelectronics/view-part?ref=eda>; AVAILABILITY: In Stock; CHECK_PRICES: https://www.snapeda.com/parts/STM32H743ZIT6/STMicroelectronics/view-part/?ref=eda; DESCRIPTION: ARM® Cortex®-M7 STM32H7 Microcontroller IC 32-Bit Single-Core 480MHz 2MB (2M x 8) FLASH 144-LQFP (20x20); MF: STMicroelectronics; MP: STM32H743ZIT6; PACKAGE: LQFP-144 STMicroelectronics; PRICE: None; PURCHASE-URL: https://www.snapeda.com/api/url_track_click_mouser/?unipart_id=1041111&manufacturer=STMicroelectronics&part_name=STM32H743ZIT6&search_term=stm32h743; SNAPEDA_LINK: https://www.snapeda.com/parts/STM32H743ZIT6/STMicroelectronics/view-part/?ref=snap; SPICEPREFIX: X
U6 U7 U10 = LIS3MDLTR:LIS3MDLTR: LIS3MDL Series 3 Axis ±2/±8/±12/±16 g 3.6V High Performance Magnetometer LGA-12 Check availability <https://pricing.snapeda.com/parts/LIS3MDLTR/STMicroelectronics/view-part?ref=eda>; AVAILABILITY: In Stock; CHECK_PRICES: https://www.snapeda.com/parts/LIS3MDLTR/STMicroelectronics/view-part/?ref=eda; DESCRIPTION: Magnetoresistive Sensor X, Y, Z Axis 12-LGA (2x2); MF: STMicroelectronics; MP: LIS3MDLTR; PACKAGE: VFLGA-12 STMicroelectronics; PRICE: None; PURCHASE-URL: https://www.snapeda.com/api/url_track_click_mouser/?unipart_id=382740&manufacturer=STMicroelectronics&part_name=LIS3MDLTR&search_term=None; SNAPEDA_LINK: https://www.snapeda.com/parts/LIS3MDLTR/STMicroelectronics/view-part/?ref=snap
U$1 = ce-capstone:STPS1L30A
X1 = con-jst2:06FLZ-SM1: CONNECTOR
X2 X3 = con-jst:06FLZ-SM1: CONNECTOR; OC_FARNELL: unknown; OC_NEWARK: unknown
Y2 = ce-capstone:ABLS-8.000MHZ-B2-T: Crystal 8MHz Â±20ppm (Tol) Â±50ppm (Stability) 18pF FUND 80Ohm 2-Pin HC-49/US SMD T/R; AVAILABILITY: Unavailable; DESCRIPTION: 8MHz ±20ppm Crystal 18pF 80 Ohms HC-49/US; MF: Abracon LLC; MP: ABLS-8.000MHZ-B2; PACKAGE: HC-49/US Abracon LLC; PRICE: None